# EAGLE design PhotonButtons (EAGLE 7.4.0)
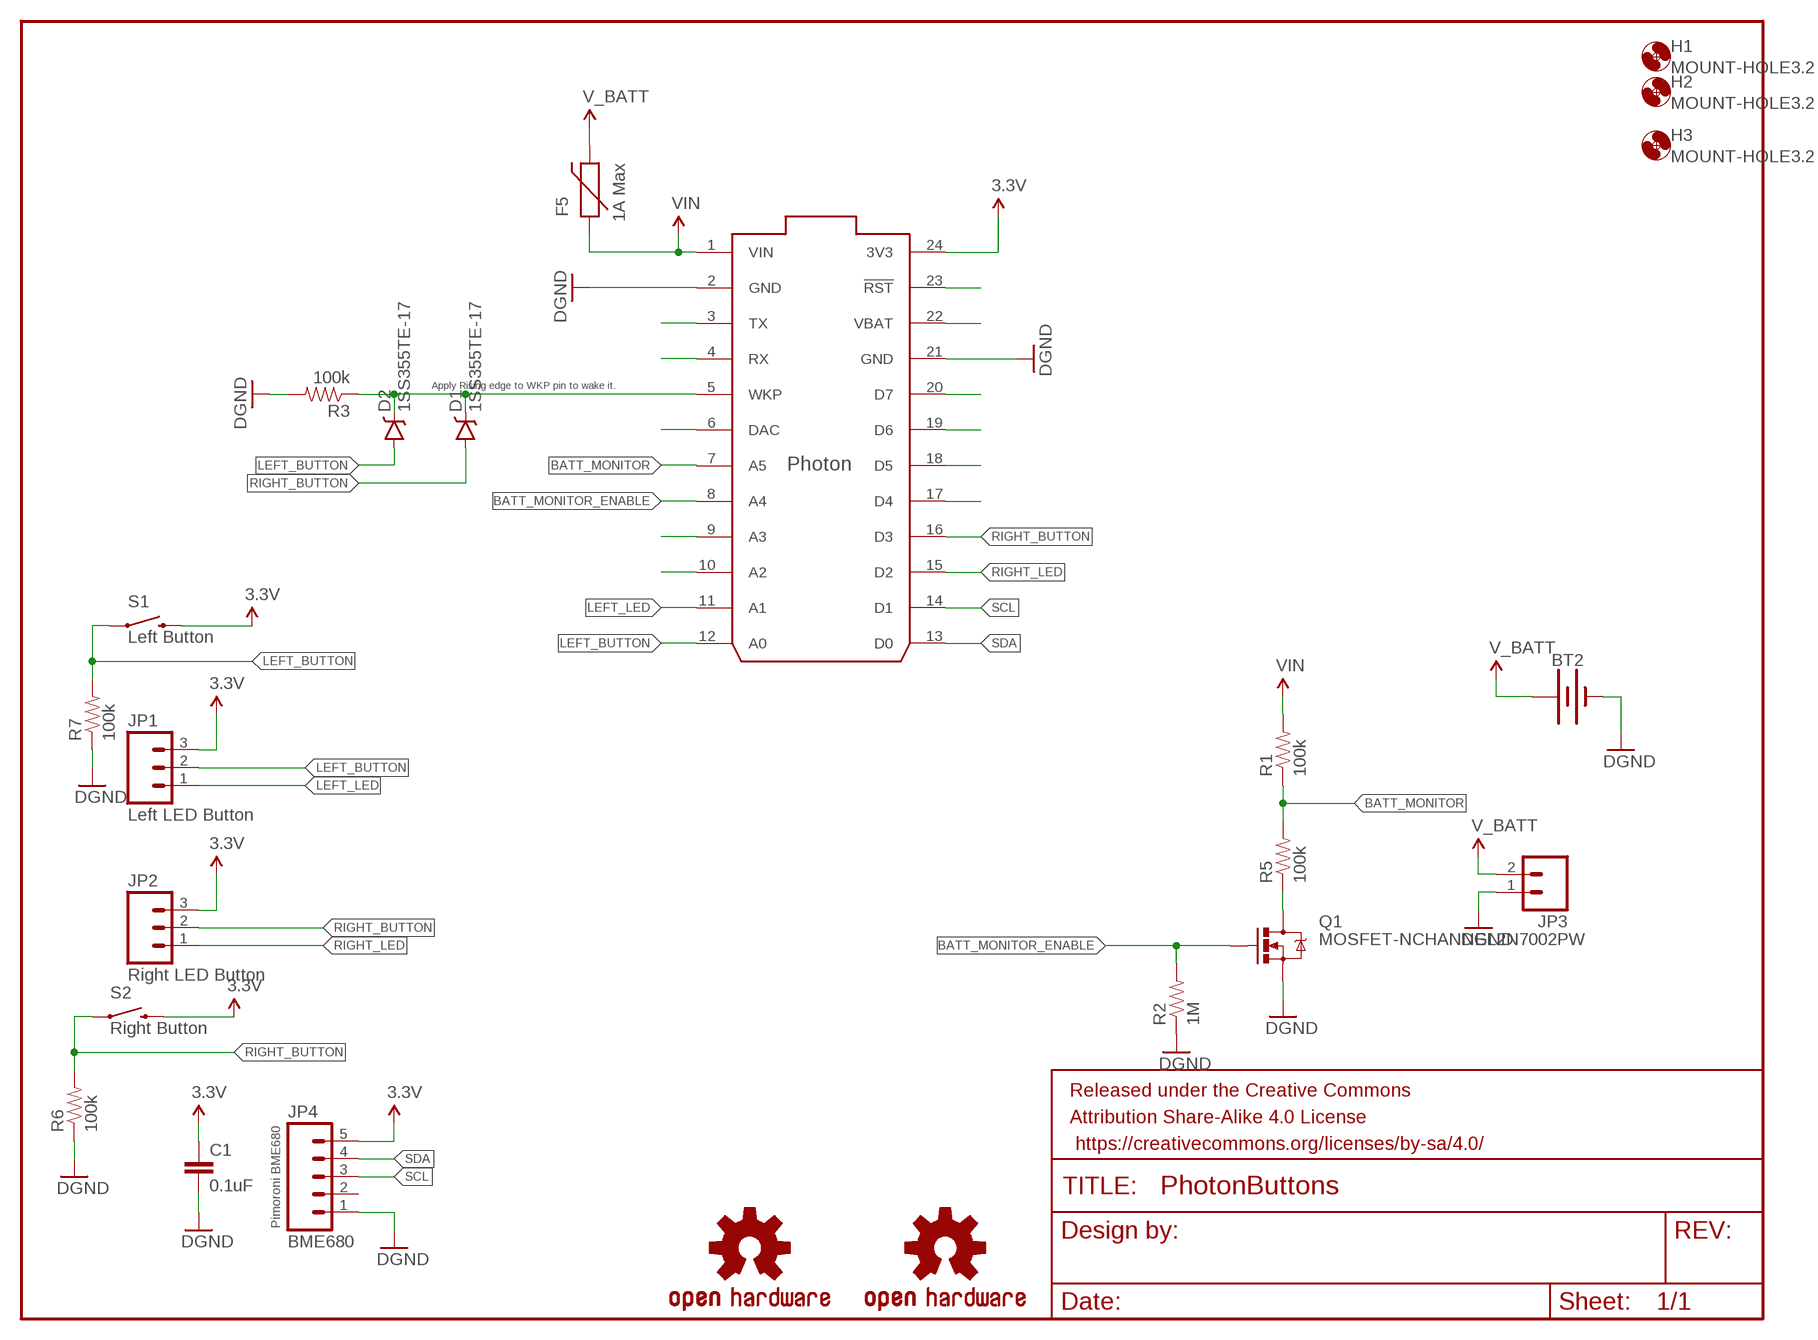
[diagram p0: schematic, sheet 1]

## Parts
BT2  BATTERY-16340  [BATTERY_16340-HOLDER]
C1  0.1uF  CAP0805  [0805]
D1  1SS355TE-17  DIODE-SCHOTTKY-BAT20J  [SOD-323]
D2  1SS355TE-17  DIODE-SCHOTTKY-BAT20J  [SOD-323]
F5  1A Max  PTCTHERMISTOR1206  [PTC-1206]
FRAME1  FRAME-LETTER  [CREATIVE_COMMONS]
H1  MOUNT-HOLE3.2  [3,2]
H2  MOUNT-HOLE3.2  [3,2]
H3  MOUNT-HOLE3.2  [3,2]
JP1  Left LED Button  M03POLAR  [MOLEX-1X3]
JP2  Right LED Button  M03POLAR  [MOLEX-1X3]
JP3  M02-JST-2MM-SMT  [JST-2-SMD]
JP4  BME680  M05PTH  [1X05]
LOGO1  OSHW-LOGOL  [OSHW-LOGO-L]
LOGO2  OSHW-LOGOL  [OSHW-LOGO-L]
Q1  MOSFET-NCHANNEL2N7002PW  [SOT323]
R1  100k  RESISTOR0805-RES  [0805]
R2  1M  RESISTOR0805-RES  [0805]
R3  100k  RESISTOR0805-RES  [0805]
R5  100k  RESISTOR0805-RES  [0805]
R6  100k  RESISTOR0805-RES  [0805]
R7  100k  RESISTOR0805-RES  [0805]
S1  Left Button  SWITCH-MOMENTARY-2PTH  [TACTILE-PTH]
S2  Right Button  SWITCH-MOMENTARY-2PTH  [TACTILE-PTH]
U$1  PHOTON_SMD  [PHOTON_SMD]

## Nets
3.3V: C1.1 JP1.3 JP2.3 JP4.5 S1.3 S2.3 U$1.24(3V3)
BATT_MONITOR: R1.1 R5.2 U$1.7(A5)
BATT_MONITOR_ENABLE: Q1.1(G) R2.2 U$1.8(A4)
GND: BT2.P$2(-) C1.2 JP3.1 JP4.1 Q1.2(S) R2.1 R3.2 R6.1 R7.1 U$1.2(GND) U$1.21(GND) ; supply symbol labelled DGND
LEFT_BUTTON: D2.A JP1.2 R7.2 S1.1 U$1.12(A0)
LEFT_LED: JP1.1 U$1.11(A1)
N$3: Q1.3(D) R5.1
N$13: U$1.17(D4)
N$14: U$1.18(D5)
N$15: U$1.19(D6)
N$16: U$1.20(D7)
N$18: U$1.22(VBAT)
N$19: U$1.23(!RST)
N$23: U$1.3(TX)
N$24: U$1.4(RX)
N$25: D1.C D2.C R3.1 U$1.5(WKP)
N$26: U$1.6(DAC)
N$29: U$1.9(A3)
N$30: U$1.10(A2)
RIGHT_BUTTON: D1.A JP2.2 R6.2 S2.1 U$1.16(D3)
RIGHT_LED: JP2.1 U$1.15(D2)
SCL: JP4.3 U$1.14(D1)
SDA: JP4.4 U$1.13(D0)
V_BATT: BT2.P$1(+) F5.2 JP3.2
VIN: F5.1 R1.2 U$1.1(VIN)
Unconnected: JP4.2 U$1.25(EN) U$1.26(!SETUP) U$1.27(RGB_RED) U$1.28(RGB_GREEN) U$1.29(RGB_BLUE) U$1.30(USB_D-) U$1.31(USB_D+)

## Notes on the sheet
- Apply Rising edge to WKP pin to wake it.
- Pimoroni BME680

## Library data of the parts
BT2 = ThingySticks:BATTERY: Battery - Single Cell A variety of battery chemistries, sizes, and footprints. Device List: 20MM_PTH - Coin Cell Battery Holder - 20mm (PTH) <https://www.sparkfun.com/products/783> 12MM_SMD - Coin Cell Battery Holder - 12mm (SMD) <https://www.sparkfun.com/products/10592> 12MM_PTH - Coin Cell Battery Holder - 12mm (PTH) <https://www.sparkfun.com/products/7948> 20MM_SMD - 20mm Coin Cell Battery Holder (SMD) (2 legs) Used on the Big Time Watch Kit <https://www.sparkfun.com/products/11734> 20MM_SMD_4LEGS - Coin Cell Battery Holder - 20mm (SMD) <https://www.sparkfun.com/products/11892> 20MM_SMD_4LEGS_OVERPASTE - Coin Cell Battery Holder - 20mm (SMD) <https://www.sparkfun.com/products/11892> (Over-paste on the legs) 24.5MM_PTH - Coin Cell Battery Holder - 24.5mm (PTH) <https://www.sparkfun.com/products/8863> 9V - 9V Battery Holder - PC Mount Used on the SparkFun SparkPunk Sound Kit <https://www.sparkfun.com/products/11177> and SparkFun SparkPunk Sequencer Kit <https://www.sparkfun.com/products/12707> 18650 - Battery Holder - 18650 (PTH) <https://www.sparkfun.com/products/13113> AA - Battery Holder - 1xAA (PTH) <https://www.sparkfun.com/products/7949> AAA - Battery Holder - 1xAAA (PTH) <https://www.sparkfun.com/products/12718> AA_KIT - Battery Holder - 1xAA (PTH) <https://www.sparkfun.com/products/7949> Special kit package - pads only have exposed copper on one side of the board. AAA_KIT - Battery Holder - 1xAAA (PTH) <https://www.sparkfun.com/products/12718> Special kit package - pads only have exposed copper on one side of the board.
C1 = SparkFun-Capacitors:CAP: Capacitor Standard 0603 ceramic capacitor, and 0.1" leaded capacitor.
D1 D2 = SparkFun-DiscreteSemi:DIODE-SCHOTTKY: Schottky diodes in SFE's production catalog BAT20J 1A 23V 0.62Vf RB751 120mA 40V 0.37Vf PMEG4005EJ 0.5A 40V 0.42Vf MBRA140 1A 40V 0.5Vf B340A 3A 40V SMA; FARNELL: 152-5435; PROD_ID: DIO-11623; VALUE: BAT20J
F5 = SparkFun-PowerIC:PTC: Resettable Fuse PTC Resettable Fuse. Spark Fun Electronics SKU : COM-08357; PROD_ID: RES-08585
FRAME1 = SparkFun-Aesthetics:FRAME-LETTER: Schematic Frame Standard 8.5x11 US Letter frame
H1-H3 = holes:MOUNT-HOLE: MOUNTING HOLE with drill center marker
JP1 JP2 = SparkFun-Connectors:M03: Header 3 Standard 3-pin 0.1" header. Use with straight break away headers (SKU : PRT-00116), right angle break away headers (PRT-00553), swiss pins (PRT-00743), machine pins (PRT-00117), and female headers (PRT-00115). Molex polarized connector foot print use with SKU : PRT-08232 with associated crimp pins and housings.
JP3 = SparkFun-Connectors:M02: Standard 2-pin 0.1" header. Use with - straight break away headers ( PRT-00116) - right angle break away headers (PRT-00553) - swiss pins (PRT-00743) - machine pins (PRT-00117) - female headers (PRT-00115) Molex polarized connector foot print use with: PRT-08233 with associated crimp pins and housings. 2.54_SCREWTERM for use with PRT-10571. 3.5mm Screw Terminal footprints for PRT-08084 5mm Screw Terminal footprints for use with PRT-08432; PROD_ID: CONN-11443
JP4 = SparkFun-Connectors:M05: Header 5 Standard 5-pin 0.1" header. Use with straight break away headers (SKU : PRT-00116), right angle break away headers (PRT-00553), swiss pins (PRT-00743), machine pins (PRT-00117), and female headers (PRT-00115). Molex polarized connector foot print use with SKU : PRT-08230 with associated crimp pins and housings.
LOGO1 LOGO2 = SparkFun-Aesthetics:OSHW-LOGO: Open Source Hardware Logo This logo indicates the piece of hardware it is found on incorporates a OSHW license and/or adheres to the definition of open source hardware found here: http://freedomdefined.org/OSHW
Q1 = SparkFun-DiscreteSemi:MOSFET-NCHANNEL: Common NMOSFET Parts MFG P/N Store ID Prod ID FDD8780 TRANS-09984 SI7820DN TRANS-11055 FDS6630A IC-08089 2N7002PW TRANS-11151 FQP30N06L COM-10213 TRANS-10060 BSS123LT1G TRANS-08345 BSS138 TRANS-00830 BS170 2N7000; FARNELL: 189-4713; PROD_ID: TRANS-11151
R1-R3 R5-R7 = SparkFun-Resistors:RESISTOR: Resistor Basic schematic elements and footprints for 0603, 1206, and PTH resistors.
S1 S2 = SparkFun-Electromechanical:SWITCH-MOMENTARY-2: Various NO switches- pushbuttons, reed, etc; PROD_ID: SWCH-08441
U$1 = Tinamous:PHOTON_SMD: Photon (without headers) - designed to be surface mounted with 7 extra exposed pads on the bottom of the board which include, 3 RGB LED outputs, /SETUP, EN (3.3V SMPS enable input), USB D+ and USB D-.

## Board
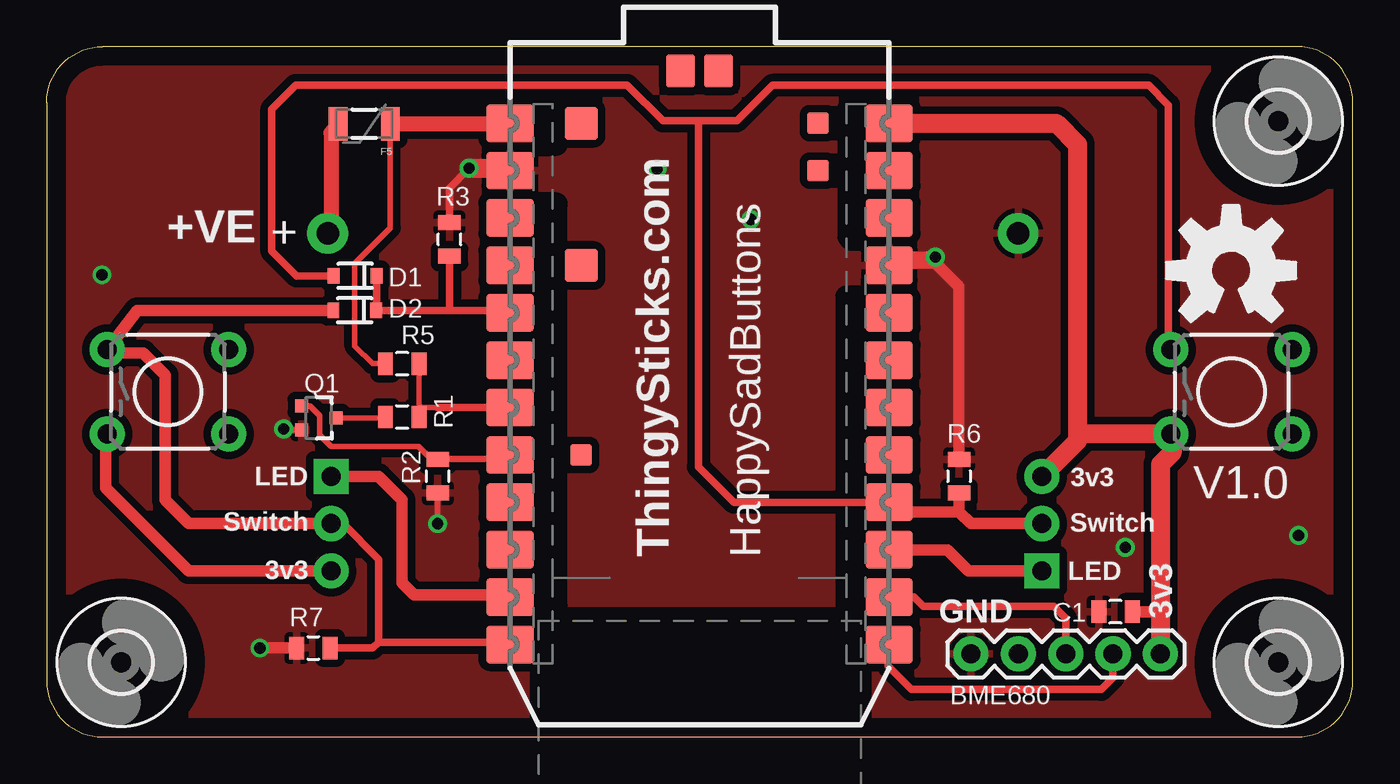
[diagram p1: board, top side]
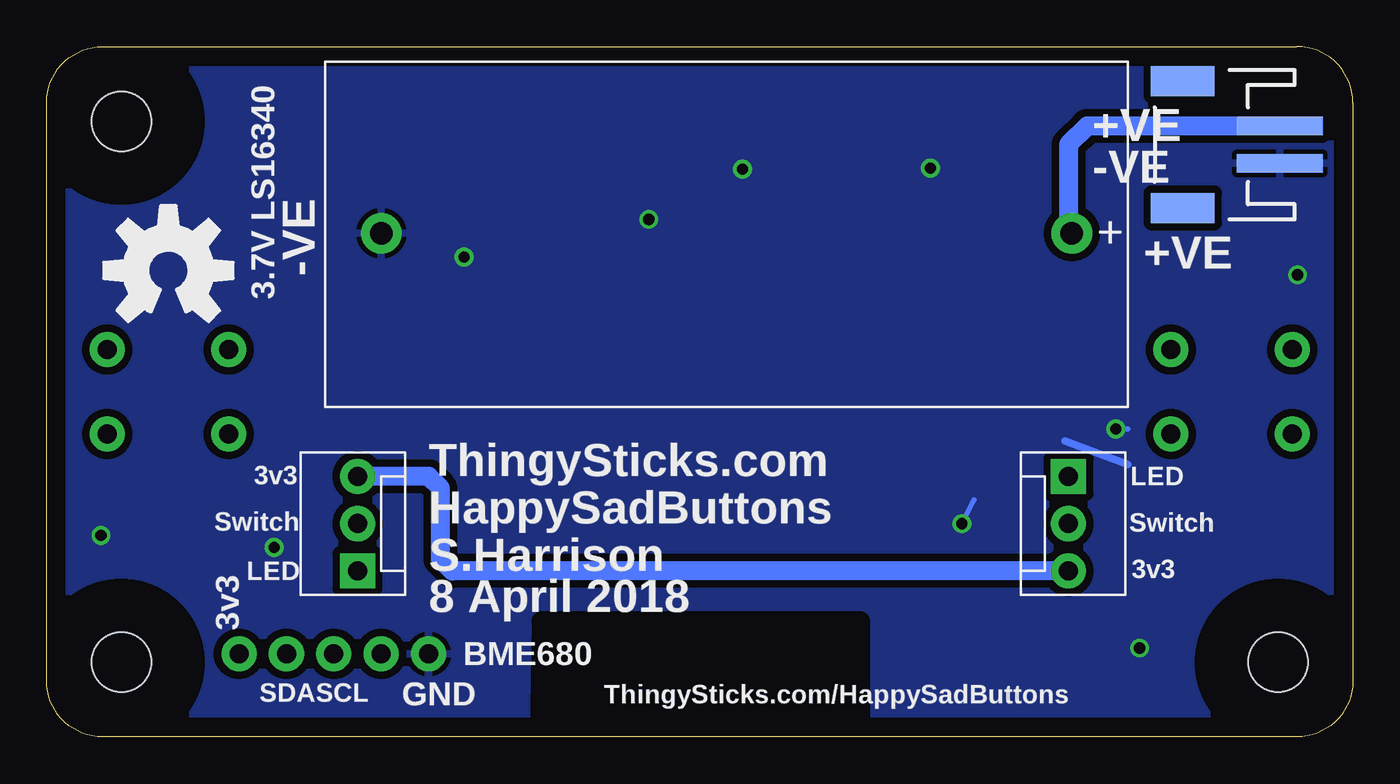
[diagram p2: board, bottom side, seen from below]

Size 70 x 37 mm. Coordinates in mm from the lower left corner, seen from the top.
Outline: 3,0 67,0 arc90 70,3 70,34 arc90 67,37 3,37 arc90 0,34 0,3 arc90 3,0
Copper layers (1*16): Top 0.035mm / dielectric 1.5mm / Bottom 0.035mm
Design rules "default": minimum track width 10mil, minimum drill 0.6mm, track to track 8mil, track to pad 8mil, pad to pad 8mil, via to via 8mil, smd to smd 8mil, copper to edge 40mil, drill to drill 8mil, minimum pad ring 10mil, minimum via ring 8mil, stop-mask expansion 4mil, vias tented up to drill 0mil, thermal gap 10mil
tRestrict: area 26.5,-3.2 to 43.6,6.4; area 26.7,4.4 to 27.3,28.6; area 42.9,6.3 to 43.5,23.6; area 43,26.7 to 43.6,33.7; area 26.7,31.8 to 27.3,33.7
bRestrict: area 26.4,-3.2 to 43.6,6.2

### Footprints (pad centres in the part's own frame; a part is rotated, then mirrored left to right if it is on the bottom)
BATTERY_16340-HOLDER = drill 1.2 pad 2.184: P$1 3,9.2; P$2 40,9.2
0805 = smd 0.8 x 1.2: 1 -0.9,0; 2 0.9,0
SOD-323 = smd 0.63 x 0.83: A 1.15,0; C -1.15,0
PTC-1206 = smd 1 x 1.8: 1 -1.4,0; 2 1.4,0
3,2 = hole 3.2: 0,0
MOLEX-1X3 = drill 1.016 pad 1.88 square: 1 0,0 | drill 1.016 pad 1.88: 2 2.54,0; 3 5.08,0
JST-2-SMD = smd 1 x 4.6: 1 -1,-3.7; 2 1,-3.7 | smd 1.6 x 3.4: NC1 -3.4,1.5; NC2 3.4,1.5
1X05 = drill 1.016 pad 1.88: 1 0,0; 2 2.54,0; 3 5.08,0; 4 7.62,0; 5 10.16,0
SOT323 = smd 0.7 x 0.7: 1 -0.65,-0.925; 2 0.65,-0.925; 3 0,0.925
TACTILE-PTH = drill 1.016 pad 1.88: 1 -3.251,2.261; 2 3.251,2.261; 3 -3.251,-2.261; 4 3.251,-2.261
PHOTON_SMD = smd 2.54 x 2.032: 1 0,32.258; 2 0,29.718; 3 0,27.178; 4 0,24.638; 5 0,22.098; 6 0,19.558; 7 0,17.018; 8 0,14.478; 9 0,11.938; 10 0,9.398; 11 0,6.858; 12 0,4.318; 13 20.32,4.318; 14 20.32,6.858; 15 20.32,9.398; 16 20.32,11.938; 17 20.32,14.478; 18 20.32,17.018; 19 20.32,19.558; 20 20.32,22.098; 21 20.32,24.638; 22 20.32,27.178; 23 20.32,29.718; 24 20.32,32.258 | smd 1.778 x 1.778: 25 3.81,32.258; 26 3.81,24.638 | smd 1.143 x 1.143: 27 3.81,14.478; 28 16.51,29.718; 29 16.51,32.258 | smd 1.524 x 1.778: 30 11.176,35.052; 31 9.144,35.052

### Placement (x,y rotation side)
BT2  12.06,36.2 180 bottom
C1  57.28,6.71 180 top
D1  16.54,24.71 180 top
D2  16.51,22.86 180 top
F5  17.02,32.87 180 top
FRAME1  20.95,-11.43 0 top  (outside the outline)
H1  4,4 0 top
H2  66,4 0 top
H3  66,33 0 top
JP1  15.24,13.97 270 bottom
JP2  53.34,8.89 90 bottom
JP3  7.62,31.75 90 bottom
JP4  49.53,4.45 0 top
LOGO1  63.48,25 0 top
LOGO2  63.48,25 0 bottom
Q1  14.58,17.09 270 top
R1  19.05,20 180 top
R2  20.95,13.97 90 top
R3  21.59,26.67 90 top
R5  19.05,17.14 0 top
R6  48.9,13.97 270 top
R7  14.29,4.76 0 top
S1  6.5,18.5 0 top
S2  63.5,18.5 0 top
U$1  24.83,0.64 0 top

### Tracks (layer width: path | path; a pad name or v marks a point on that pad's centre or on a via)
3.3V
  Top 0.61: C1.1 59.77,6.71 59.69,5.71 JP4.5 | JP1.3 7.62,8.89 3.17,13.34 3.17,16.02 S1.3
  Top 1.016: U$1.24 54.1,32.89 55.24,31.75 55.24,16.51 | JP2.3 55.24,15.88 55.24,16.51 | JP4.5 59.69,14.61 60.33,15.24 60.33,16.16 S2.3 55.52,16.24 55.24,16.51
  Bottom 1.016: JP1.3 48.26,8.89 48.9,9.53 48.9,13.34 49.53,13.97 JP2.3
BATT_MONITOR
  Top 0.305: R5.2 19.95,17.78 | 19.95,17.78 R1.1 | 20.96,17.65 20.08,17.65 19.95,17.78
  Top 0.406: U$1.7 20.96,17.65
BATT_MONITOR_ENABLE
  Top 0.305: 24.11,15.09 U$1.8 23.95,14.94 23.5,14.94 | Q1.1 14.11,17.74 14.63,17.22 14.63,16.18 15.24,15.57 19.94,15.57 20.57,14.94 23.5,14.94 | R2.2 23.43,14.87 23.5,14.94
GND  (via drill 0.6)
  Top 0.305: Q1.2 12.77,16.44 v12.7,16.51 | R2.1 v20.95,11.43
  Top 0.406: R3.2 21.59,29.43 v22.64,30.48
  Top 0.61: R7.1 v11.43,4.76 | v47.62,25.72 44.9,25.72 U$1.21 44.58,25.4 47.62,25.4 48.9,24.13 R6.1
  Top 1.016: v22.64,30.48 24,30.48 U$1.2
  Bottom 0.305: v12.7,16.51 12.06,16.51 | v20.95,11.43 20.32,12.7
  Bottom 0.406: 15.44,15.85 12.06,14.61
  other vias: 57.81,10.16 2.96,24.77 67.09,10.79 37.73,27.74 32.7,30.43
  pour Bottom (isolate 0.406, rank 6): -0.64,37.47 -0.64,-0.64 70.48,-0.64 70.48,37.47
  pour Top (isolate 0.406, rank 6): 0,37.47 70.48,37.47 70.48,-0.64 -0.64,-0.64 -0.64,37.47
LEFT_BUTTON
  Top 0.406: 17.78,5.08 24,5.08 U$1.12 | R7.2 17.46,4.76 17.78,5.08 | 17.78,5.08 17.78,9.53 15.88,11.43
  Top 0.61: 15.88,11.43 JP1.2 7.62,11.43 6.35,12.7 6.35,19.41 5.18,20.57 3.01,20.57 S1.1 4.86,22.86 D2.A
LEFT_LED
  Top 0.61: JP1.1 17.78,13.97 19.05,12.7 19.05,8.26 19.68,7.62 24.7,7.62 U$1.11
N$3
  Top 0.305: Q1.3 18.1,17.09 R5.1
N$25
  Top 0.406: 21.59,22.86 D2.C 17.68,22.89 D1.C | 21.59,22.86 24,22.86 U$1.5 | R3.1 21.59,22.86
RIGHT_BUTTON
  Top 0.406: U$1.16 36.83,12.57 34.92,14.48 34.92,33.02 | D1.A 13.39,24.71 12.06,26.04 12.06,33.66 13.34,34.92 31.11,34.92 33.02,33.02 34.92,33.02 | 34.92,33.02 36.98,33.02 38.89,34.92 59.05,34.92 60.11,33.87 60.11,20.9 S2.1
  Top 0.61: 48.9,12.06 49.53,11.43 JP2.2 | 48.9,12.06 44.96,12.06 U$1.16 | R6.2 48.9,12.06
RIGHT_LED
  Top 0.61: U$1.15 48.26,10.03 49.4,8.89 JP2.1
SCL
  Top 0.406: 44.32,7.62 U$1.14 46.48,7.49 46.99,6.99 53.98,6.99 54.61,6.35 JP4.3
SDA
  Top 0.406: 44.51,5.01 U$1.13 45.09,3.81 46.35,2.54 56.52,2.54 57.15,3.17 JP4.4
V_BATT
  Top 0.813: F5.2 15.62,32.76 15.24,32.38 15.24,27.17 BT2.P$1
  Bottom 1.016: JP3.2 14.24,32.75 15.24,31.75 15.24,27.17 BT2.P$1
VIN
  Top 0.305: R1.2 17.46,20 16.51,20.95 16.51,25.38 18.41,27.28 F5.1
  Top 0.813: F5.1 24.11,32.87 U$1.1

### Text on the board
tNames: +VE | LED | 3v3 | V1.0 | Switch | Switch | ThingySticks.com | HappySadButtons | 3v3 | LED | GND | 3v3
bNames: 3.7V LS16340 | +VE | -VE | +VE | -VE | 3v3 | ThingySticks.com | LED | Switch | Switch | HappySadButtons | S.Harrison | LED | 3v3 | 8 April 2018 | 3v3 | BME680 | ThingySticks.com/HappySadButtons | GND | SCL | SDA
Document: Stephen Harrison